# Altium schematic sheet LCD_Keypad.SchDoc
size A
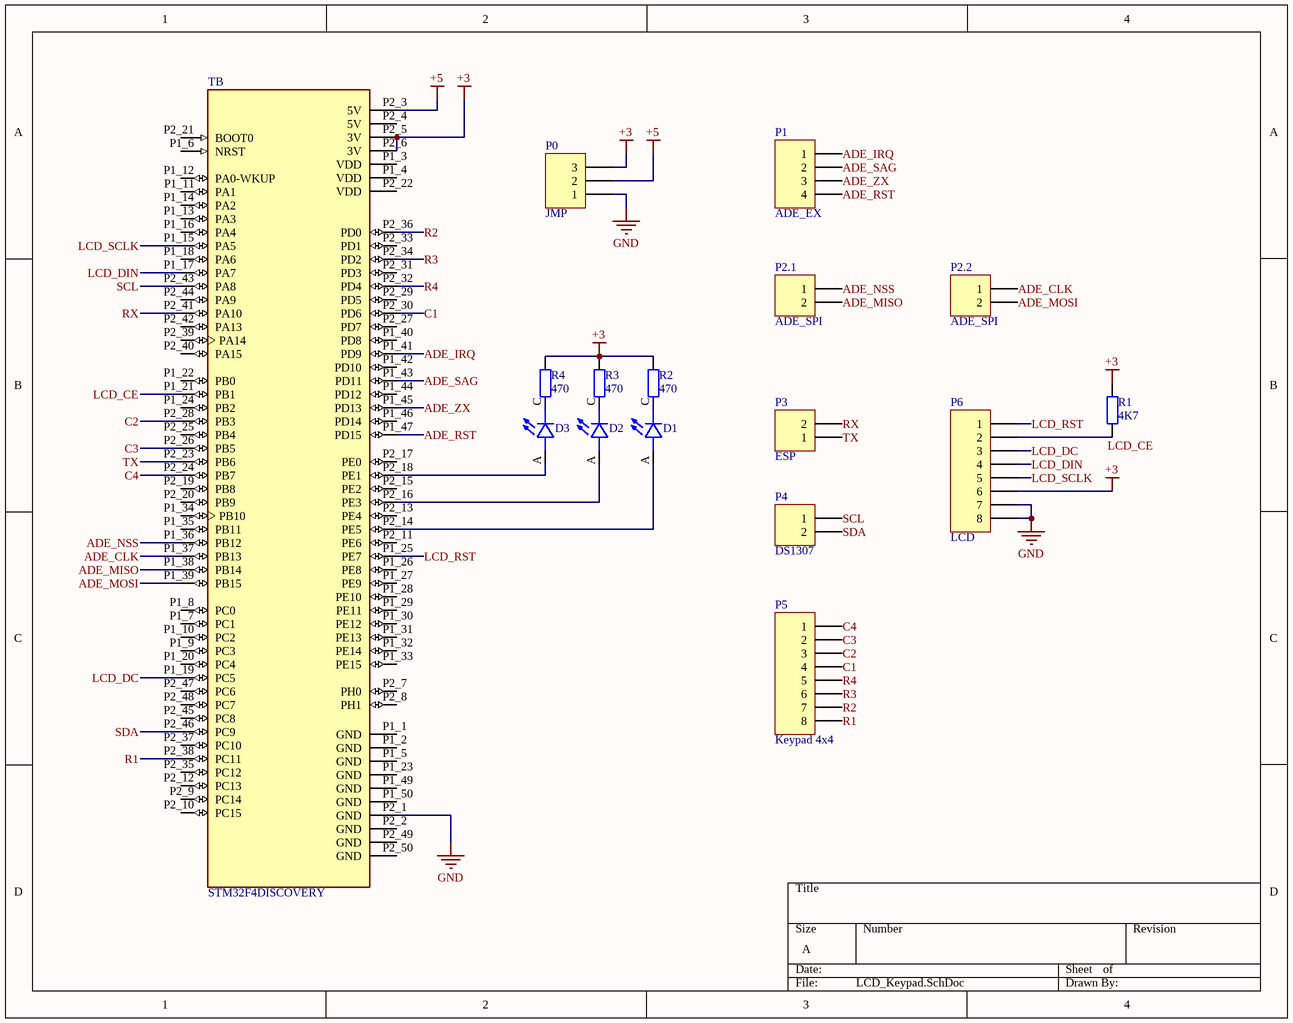
[diagram p0: LCD_Keypad.SchDoc]

## Parts
D1  L08R5000Q1  [LEDRD254W57D500H1070]  (value not drawn)
D2  L08R5000Q1  [LEDRD254W57D500H1070]  (value not drawn)
D3  L08R5000Q1  [LEDRD254W57D500H1070]  (value not drawn)
P0  JMP  [HDR1X3]
P1  ADE_EX  [HDR1X4]
P2.1  ADE_SPI  [HDR1X2]
P2.2  ADE_SPI  [HDR1X2]
P3  ESP  [HDR1X2]
P4  DS1307  [HDR1X2]
P5  Keypad 4x4  [HDR1X8]
P6  LCD  [HDR1X8]
R1  value 4K7  [AXIAL-0.4]  (hidden comment: Res2)
R2  value 470  [AXIAL-0.4]  (hidden comment: Res2)
R3  value 470  [AXIAL-0.4]  (hidden comment: Res2)
R4  value 470  [AXIAL-0.4]  (hidden comment: Res2)
TB  STM32F4DISCOVERY  [MODULE_STM32F4DISCOVERY]

## Nets
+3: P0.3 P6.6 R1.2 R2.1 R3.1 R4.1 TB.P2_5(3V) TB.P2_6(3V)
+5: P0.2 TB.P2_3(5V)
GND: P0.1 P6.7 P6.8 TB.P2_1(GND)
ADE_CLK: P2.2.1 TB.P1_37(PB13)
ADE_IRQ: P1.1 TB.P1_41(PD9)
ADE_MISO: P2.1.2 TB.P1_38(PB14)
ADE_MOSI: P2.2.2 TB.P1_39(PB15)
ADE_NSS: P2.1.1 TB.P1_36(PB12)
ADE_RST: P1.4 TB.P1_47(PD15)
ADE_SAG: P1.2 TB.P1_43(PD11)
ADE_ZX: P1.3 TB.P1_45(PD13)
C1: P5.4 TB.P2_30(PD6)
C2: P5.3 TB.P2_28(PB3)
C3: P5.2 TB.P2_26(PB5)
C4: P5.1 TB.P2_24(PB7)
LCD_CE: P6.2 R1.1 TB.P1_21(PB1)
LCD_DC: P6.3 TB.P1_19(PC5)
LCD_DIN: P6.4 TB.P1_17(PA7)
LCD_RST: P6.1 TB.P1_25(PE7)
LCD_SCLK: P6.5 TB.P1_15(PA5)
R1: P5.8 TB.P2_38(PC11)
R2: P5.7 TB.P2_36(PD0)
R3: P5.6 TB.P2_34(PD2)
R4: P5.5 TB.P2_32(PD4)
RX: P3.2 TB.P2_41(PA10)
SCL: P4.1 TB.P2_43(PA8)
SDA: P4.2 TB.P2_46(PC9)
TX: P3.1 TB.P2_23(PB6)
NetD1_A: D1.A TB.P2_14(PE5)
NetD1_C: D1.C R2.2
NetD2_A: D2.A TB.P2_16(PE3)
NetD2_C: D2.C R3.2
NetD3_A: D3.A TB.P2_18(PE1)
NetD3_C: D3.C R4.2

Not connected (* = marked no-connect by the designer): TB P1_1(GND) P1_2(GND) P1_3(VDD) P1_4(VDD) P1_5(GND) P1_6(NRST) P1_7(PC1) P1_8(PC0) P1_9(PC3) P1_10(PC2) P1_11(PA1) P1_12(PA0-WKUP) P1_13(PA3) P1_14(PA2) P1_16(PA4) P1_18(PA6) P1_20(PC4) P1_22(PB0) P1_23(GND) P1_24(PB2) P1_26(PE8) P1_27(PE9) P1_28(PE10) P1_29(PE11) P1_30(PE12) P1_31(PE13) P1_32(PE14) P1_33(PE15) P1_34(PB10) P1_35(PB11) P1_40(PD8) P1_42(PD10) P1_44(PD12) P1_46(PD14) P1_49(GND) P1_50(GND) P2_2(GND) P2_4(5V) P2_7(PH0) P2_8(PH1) P2_9(PC14) P2_10(PC15) P2_11(PE6) P2_12(PC13) P2_13(PE4) P2_15(PE2) P2_17(PE0) P2_19(PB8) P2_20(PB9) P2_21(BOOT0) P2_22(VDD) P2_25(PB4) P2_27(PD7) P2_29(PD5) P2_31(PD3) P2_33(PD1) P2_35(PC12) P2_37(PC10) P2_39(PA14) P2_40(PA15) P2_42(PA13) P2_44(PA9) P2_45(PC8) P2_47(PC6) P2_48(PC7) P2_49(GND) P2_50(GND)

## Library data of the parts
D1-D3 = L08R5000Q1: LED, Orange, Through Hole, T-1 3/4 (5mm), 30 mA, 2.1 V, 635 nm; MF: {'manufacturer': u'LED Technology'}; Value: *; Price: None; Package: None; Availability: Unavailable; MP: L08R5000Q1
P0 = Header 3: Header, 3-Pin; LatestRevisionDate: 17-Jul-2002; LatestRevisionNote: Re-released for DXP Platform.; Publisher: Altium Limited
P1 = Header 4: Header, 4-Pin; LatestRevisionDate: 17-Jul-2002; LatestRevisionNote: Re-released for DXP Platform.; Publisher: Altium Limited
P2.1 P2.2 P3 P4 = Header 2: Header, 2-Pin; LatestRevisionDate: 17-Jul-2002; LatestRevisionNote: Re-released for DXP Platform.; Publisher: Altium Limited
P5 P6 = Header 8: Header, 8-Pin; LatestRevisionDate: 17-Jul-2002; LatestRevisionNote: Re-released for DXP Platform.; Publisher: Altium Limited
R1-R4 = Res2: Resistor; Published: 8-Jun-2000; LatestRevisionDate: 17-Jul-2002; LatestRevisionNote: Re-released for DXP Platform.; PackageReference: AXIAL-0.4; Publisher: Altium Limited; PackageDescription: Axial Device, Thru-Hole; 2 Leads; 0.4 in Pin Spacing
TB = STM32F4DISCOVERY: STM32F407VGT6 Discovery STM32F4 ARMÂ® CortexÂ®-M4 MCU 32-Bit Embedded Evaluation Board; MF: STMicroelectronics; MP: STM32F4DISCOVERY; Package: None; Price: None; Availability: Unavailable; Value: *; SnapEDA_Link: https://www.snapeda.com/parts/STM32F4DISCOVERY/STMicroelectronics/view-part/46335/?ref=snap